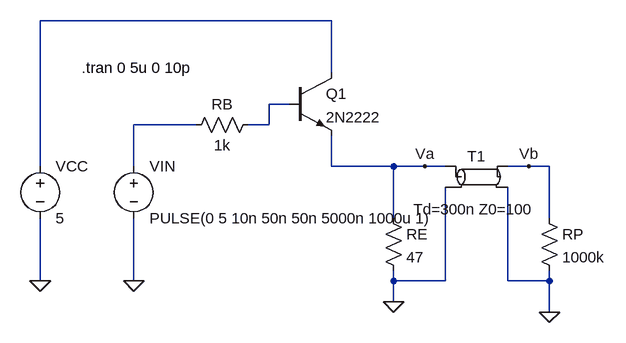
[diagram p0: schematic Draft4.asc]
Draft4.asc, the LTspice schematic file:
Version 4
SHEET 1 1016 680
WIRE 464 32 16 32
WIRE 464 112 464 32
WIRE 400 160 368 160
WIRE 256 192 160 192
WIRE 368 192 368 160
WIRE 368 192 336 192
WIRE 16 256 16 32
WIRE 160 256 160 192
WIRE 464 256 464 208
WIRE 560 256 464 256
WIRE 608 256 560 256
WIRE 640 256 608 256
WIRE 768 256 736 256
WIRE 800 256 768 256
WIRE 560 336 560 256
WIRE 800 336 800 256
WIRE 16 432 16 336
WIRE 160 432 160 336
WIRE 560 432 560 416
WIRE 640 432 640 288
WIRE 640 432 560 432
WIRE 736 432 736 288
WIRE 800 432 800 416
WIRE 800 432 736 432
WIRE 560 464 560 432
WIRE 800 480 800 432
FLAG 16 432 0
FLAG 160 432 0
FLAG 560 464 0
FLAG 800 480 0
FLAG 608 256 Va
FLAG 768 256 Vb
SYMBOL voltage 16 240 R0
SYMATTR InstName VCC
SYMATTR Value 5
SYMBOL voltage 160 240 R0
SYMATTR InstName VIN
SYMATTR Value PULSE(0 5 10n 50n 50n 5000n 1000u 1)
SYMBOL npn 400 112 R0
SYMATTR InstName Q1
SYMATTR Value 2N2222
SYMBOL res 544 320 R0
SYMATTR InstName RE
SYMATTR Value 47
SYMBOL res 784 320 R0
SYMATTR InstName RP
SYMATTR Value 1000k
SYMBOL res 352 176 R90
WINDOW 0 0 56 VBottom 2
WINDOW 3 32 56 VTop 2
SYMATTR InstName RB
SYMATTR Value 1k
SYMBOL tline 688 272 R0
WINDOW 3 -4 34 Top 2
SYMATTR Value Td=300n Z0=100
SYMATTR InstName T1
TEXT 80 104 Left 2 !.tran 0 5u 0 10p

The netlist it stands for:
* Draft4.asc
VCC N001 0 5
VIN N003 0 PULSE(0 5 10n 50n 50n 5000n 1000u 1)
Q1 N001 N002 Va 0 2N2222
RE Va 0 47
RP Vb 0 1000k
RB N002 N003 1k
T1 Va 0 Vb 0 Td=300n Z0=100
.model NPN NPN
.model PNP PNP
.lib standard.bjt
.tran 0 5u 0 10p
.backanno
.end